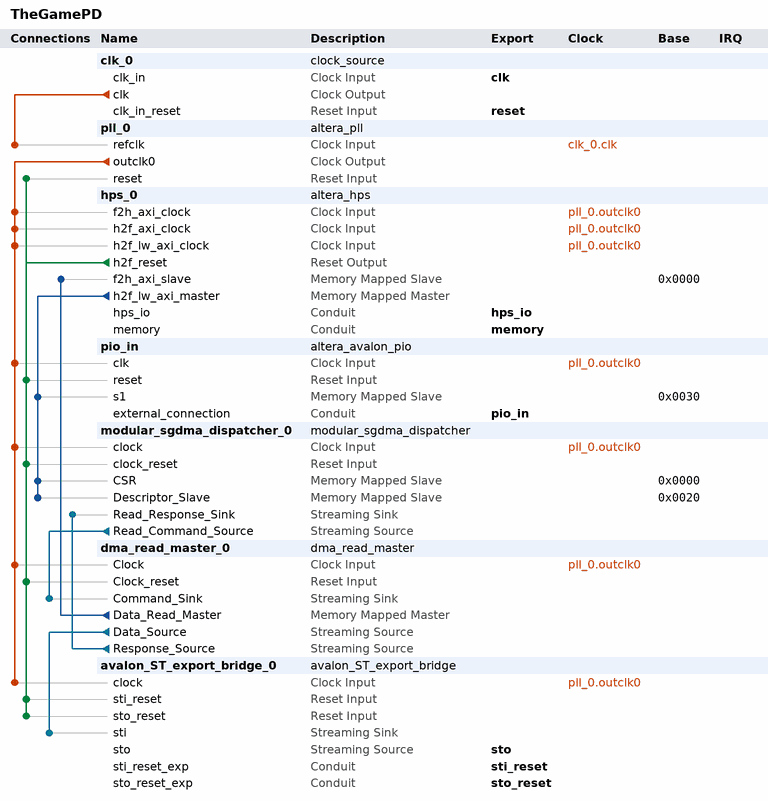
[diagram p0: system contents]
# Platform Designer (Qsys) system TheGamePD, Cyclone V 5CSXFC6D6F31C6
# Parameters at their usual value, and those the tool derives, are not listed.
package require -exact qsys 18.0
create_system TheGamePD
set_project_property DEVICE_FAMILY {Cyclone V}
set_project_property DEVICE 5CSXFC6D6F31C6

add_instance clk_0 clock_source 18.0
set_instance_parameter_value clk_0 clockFrequency 50000000

add_instance pll_0 altera_pll 18.0
set_instance_parameter_value pll_0 gui_device_speed_grade 2
set_instance_parameter_value pll_0 gui_number_of_clocks 1
set_instance_parameter_value pll_0 gui_operation_mode direct
set_instance_parameter_value pll_0 gui_output_clock_frequency0 100.0
set_instance_parameter_value pll_0 gui_pll_mode {Integer-N PLL}
set_instance_parameter_value pll_0 gui_reference_clock_frequency 50.0
set_instance_parameter_value pll_0 gui_use_locked true

add_instance hps_0 altera_hps 18.0
set_instance_parameter_value hps_0 EMAC1_Mode RGMII
set_instance_parameter_value hps_0 EMAC1_PinMuxing {HPS I/O Set 0}
set_instance_parameter_value hps_0 F2SCLK_COLDRST_Enable false
set_instance_parameter_value hps_0 F2SCLK_DBGRST_Enable false
set_instance_parameter_value hps_0 F2SCLK_WARMRST_Enable false
set_instance_parameter_value hps_0 F2SINTERRUPT_Enable true
set_instance_parameter_value hps_0 F2S_Width 2
set_instance_parameter_value hps_0 FPGA_PERIPHERAL_OUTPUT_CLOCK_FREQ_EMAC0_GTX_CLK 100
set_instance_parameter_value hps_0 FPGA_PERIPHERAL_OUTPUT_CLOCK_FREQ_EMAC0_MD_CLK 100.0
set_instance_parameter_value hps_0 FPGA_PERIPHERAL_OUTPUT_CLOCK_FREQ_EMAC1_GTX_CLK 100
set_instance_parameter_value hps_0 FPGA_PERIPHERAL_OUTPUT_CLOCK_FREQ_EMAC1_MD_CLK 100.0
set_instance_parameter_value hps_0 HPS_PROTOCOL DDR3
set_instance_parameter_value hps_0 I2C0_Mode I2C
set_instance_parameter_value hps_0 I2C0_PinMuxing {HPS I/O Set 0}
set_instance_parameter_value hps_0 I2C1_Mode I2C
set_instance_parameter_value hps_0 I2C1_PinMuxing {HPS I/O Set 0}
set_instance_parameter_value hps_0 LWH2F_Enable true
set_instance_parameter_value hps_0 MEM_BANKADDR_WIDTH 3
set_instance_parameter_value hps_0 MEM_CLK_FREQ 400.0
set_instance_parameter_value hps_0 MEM_COL_ADDR_WIDTH 10
set_instance_parameter_value hps_0 MEM_DQ_WIDTH 32
set_instance_parameter_value hps_0 MEM_DRV_STR RZQ/6
set_instance_parameter_value hps_0 MEM_ROW_ADDR_WIDTH 15
set_instance_parameter_value hps_0 MEM_RTT_NOM RZQ/6
set_instance_parameter_value hps_0 MEM_RTT_WR {Dynamic ODT off}
set_instance_parameter_value hps_0 MEM_TCL 11
set_instance_parameter_value hps_0 MEM_TFAW_NS 45.0
set_instance_parameter_value hps_0 MEM_TRAS_NS 35.0
set_instance_parameter_value hps_0 MEM_TRCD_NS 13.75
set_instance_parameter_value hps_0 MEM_TRFC_NS 260.0
set_instance_parameter_value hps_0 MEM_TRP_NS 13.75
set_instance_parameter_value hps_0 MEM_VENDOR Micron
set_instance_parameter_value hps_0 MEM_WTCL 7
set_instance_parameter_value hps_0 QSPI_Mode {1 SS}
set_instance_parameter_value hps_0 QSPI_PinMuxing {HPS I/O Set 0}
set_instance_parameter_value hps_0 REF_CLK_FREQ 25.0
set_instance_parameter_value hps_0 S2FCLK_USER2CLK 5
set_instance_parameter_value hps_0 S2F_Width 2
set_instance_parameter_value hps_0 SDIO_Mode {4-bit Data}
set_instance_parameter_value hps_0 SDIO_PinMuxing {HPS I/O Set 0}
set_instance_parameter_value hps_0 SPIM0_Mode {Single Slave Select}
set_instance_parameter_value hps_0 SPIM0_PinMuxing {HPS I/O Set 0}
set_instance_parameter_value hps_0 SPIM1_Mode {Single Slave Select}
set_instance_parameter_value hps_0 SPIM1_PinMuxing {HPS I/O Set 0}
set_instance_parameter_value hps_0 STM_Enable false
set_instance_parameter_value hps_0 TIMING_BOARD_AC_SKEW 0.02
set_instance_parameter_value hps_0 TIMING_BOARD_AC_TO_CK_SKEW 0.01
set_instance_parameter_value hps_0 TIMING_BOARD_DQ_TO_DQS_SKEW 0.05
set_instance_parameter_value hps_0 TIMING_BOARD_MAX_CK_DELAY 0.03
set_instance_parameter_value hps_0 TIMING_BOARD_MAX_DQS_DELAY 0.02
set_instance_parameter_value hps_0 TIMING_BOARD_SKEW_BETWEEN_DQS 0.06
set_instance_parameter_value hps_0 TIMING_BOARD_SKEW_CKDQS_DIMM_MAX 0.12
set_instance_parameter_value hps_0 TIMING_BOARD_SKEW_CKDQS_DIMM_MIN 0.06
set_instance_parameter_value hps_0 TIMING_BOARD_SKEW_WITHIN_DQS 0.01
set_instance_parameter_value hps_0 TIMING_TDH 65
set_instance_parameter_value hps_0 TIMING_TDQSCK 255
set_instance_parameter_value hps_0 TIMING_TDQSQ 125
set_instance_parameter_value hps_0 TIMING_TDS 30
set_instance_parameter_value hps_0 TIMING_TIH 140
set_instance_parameter_value hps_0 TIMING_TIS 190
set_instance_parameter_value hps_0 TIMING_TQSH 0.4
set_instance_parameter_value hps_0 UART0_Mode {No Flow Control}
set_instance_parameter_value hps_0 UART0_PinMuxing {HPS I/O Set 0}
set_instance_parameter_value hps_0 USB1_Mode SDR
set_instance_parameter_value hps_0 USB1_PinMuxing {HPS I/O Set 0}
set_instance_parameter_value hps_0 desired_cfg_clk_mhz 100.0
set_instance_parameter_value hps_0 desired_qspi_clk_mhz 400.0

add_instance pio_in altera_avalon_pio 18.0
set_instance_parameter_value pio_in direction Input
set_instance_parameter_value pio_in width 5

add_instance modular_sgdma_dispatcher_0 modular_sgdma_dispatcher 18.0
set_instance_parameter_value modular_sgdma_dispatcher_0 BURST_ENABLE 0
set_instance_parameter_value modular_sgdma_dispatcher_0 BURST_WRAPPING_SUPPORT 0
set_instance_parameter_value modular_sgdma_dispatcher_0 CSR_ADDRESS_WIDTH 3
set_instance_parameter_value modular_sgdma_dispatcher_0 DATA_FIFO_DEPTH 32
set_instance_parameter_value modular_sgdma_dispatcher_0 DATA_WIDTH 32
set_instance_parameter_value modular_sgdma_dispatcher_0 DESCRIPTOR_FIFO_DEPTH 128
set_instance_parameter_value modular_sgdma_dispatcher_0 ENHANCED_FEATURES 0
set_instance_parameter_value modular_sgdma_dispatcher_0 GUI_RESPONSE_PORT 0
set_instance_parameter_value modular_sgdma_dispatcher_0 MAX_BURST_COUNT 2
set_instance_parameter_value modular_sgdma_dispatcher_0 MAX_BYTE 1024
set_instance_parameter_value modular_sgdma_dispatcher_0 MAX_STRIDE 1
set_instance_parameter_value modular_sgdma_dispatcher_0 MODE 1
set_instance_parameter_value modular_sgdma_dispatcher_0 PREFETCHER_USE_CASE 0
set_instance_parameter_value modular_sgdma_dispatcher_0 PROGRAMMABLE_BURST_ENABLE 0
set_instance_parameter_value modular_sgdma_dispatcher_0 STRIDE_ENABLE 0
set_instance_parameter_value modular_sgdma_dispatcher_0 TRANSFER_TYPE {Aligned Accesses}

add_instance dma_read_master_0 dma_read_master 18.0
set_instance_parameter_value dma_read_master_0 BURST_ENABLE 0
set_instance_parameter_value dma_read_master_0 CHANNEL_ENABLE 0
set_instance_parameter_value dma_read_master_0 CHANNEL_WIDTH 8
set_instance_parameter_value dma_read_master_0 DATA_WIDTH 8
set_instance_parameter_value dma_read_master_0 ERROR_ENABLE 0
set_instance_parameter_value dma_read_master_0 ERROR_WIDTH 8
set_instance_parameter_value dma_read_master_0 FIFO_DEPTH 32
set_instance_parameter_value dma_read_master_0 FIFO_SPEED_OPTIMIZATION 1
set_instance_parameter_value dma_read_master_0 FIX_ADDRESS_WIDTH 32
set_instance_parameter_value dma_read_master_0 GUI_BURST_WRAPPING_SUPPORT 0
set_instance_parameter_value dma_read_master_0 GUI_MAX_BURST_COUNT 2
set_instance_parameter_value dma_read_master_0 GUI_PROGRAMMABLE_BURST_ENABLE 0
set_instance_parameter_value dma_read_master_0 GUI_STRIDE_WIDTH 1
set_instance_parameter_value dma_read_master_0 LENGTH_WIDTH 32
set_instance_parameter_value dma_read_master_0 PACKET_ENABLE 1
set_instance_parameter_value dma_read_master_0 STRIDE_ENABLE 0
set_instance_parameter_value dma_read_master_0 TRANSFER_TYPE {Aligned Accesses}
set_instance_parameter_value dma_read_master_0 USE_FIX_ADDRESS_WIDTH 0

add_instance avalon_ST_export_bridge_0 avalon_ST_export_bridge 1.0
set_instance_parameter_value avalon_ST_export_bridge_0 data_width 8

# connections
add_connection clk_0.clk pll_0.refclk clock
add_connection pll_0.outclk0 avalon_ST_export_bridge_0.clock clock
add_connection pll_0.outclk0 dma_read_master_0.Clock clock
add_connection pll_0.outclk0 hps_0.f2h_axi_clock clock
add_connection pll_0.outclk0 hps_0.h2f_axi_clock clock
add_connection pll_0.outclk0 hps_0.h2f_lw_axi_clock clock
add_connection pll_0.outclk0 modular_sgdma_dispatcher_0.clock clock
add_connection pll_0.outclk0 pio_in.clk clock
add_connection hps_0.h2f_reset avalon_ST_export_bridge_0.sti_reset reset
add_connection hps_0.h2f_reset avalon_ST_export_bridge_0.sto_reset reset
add_connection hps_0.h2f_reset dma_read_master_0.Clock_reset reset
add_connection hps_0.h2f_reset modular_sgdma_dispatcher_0.clock_reset reset
add_connection hps_0.h2f_reset pio_in.reset reset
add_connection hps_0.h2f_reset pll_0.reset reset
add_connection dma_read_master_0.Data_Read_Master hps_0.f2h_axi_slave avalon
set_connection_parameter_value dma_read_master_0.Data_Read_Master/hps_0.f2h_axi_slave baseAddress 0x0000
add_connection hps_0.h2f_lw_axi_master modular_sgdma_dispatcher_0.CSR avalon
set_connection_parameter_value hps_0.h2f_lw_axi_master/modular_sgdma_dispatcher_0.CSR baseAddress 0x0000
add_connection hps_0.h2f_lw_axi_master modular_sgdma_dispatcher_0.Descriptor_Slave avalon
set_connection_parameter_value hps_0.h2f_lw_axi_master/modular_sgdma_dispatcher_0.Descriptor_Slave baseAddress 0x0020
add_connection hps_0.h2f_lw_axi_master pio_in.s1 avalon
set_connection_parameter_value hps_0.h2f_lw_axi_master/pio_in.s1 baseAddress 0x0030
add_connection dma_read_master_0.Data_Source avalon_ST_export_bridge_0.sti avalon_streaming
add_connection dma_read_master_0.Response_Source modular_sgdma_dispatcher_0.Read_Response_Sink avalon_streaming
add_connection modular_sgdma_dispatcher_0.Read_Command_Source dma_read_master_0.Command_Sink avalon_streaming

# exported interfaces
add_interface clk clock sink
set_interface_property clk EXPORT_OF clk_0.clk_in
add_interface hps_io conduit end
set_interface_property hps_io EXPORT_OF hps_0.hps_io
add_interface memory conduit end
set_interface_property memory EXPORT_OF hps_0.memory
add_interface pio_in conduit end
set_interface_property pio_in EXPORT_OF pio_in.external_connection
add_interface reset reset sink
set_interface_property reset EXPORT_OF clk_0.clk_in_reset
add_interface sti_reset conduit end
set_interface_property sti_reset EXPORT_OF avalon_ST_export_bridge_0.sti_reset_exp
add_interface sto avalon_streaming source
set_interface_property sto EXPORT_OF avalon_ST_export_bridge_0.sto
add_interface sto_reset conduit end
set_interface_property sto_reset EXPORT_OF avalon_ST_export_bridge_0.sto_reset_exp

set_interconnect_requirement {$system} qsys_mm.clockCrossingAdapter HANDSHAKE
set_interconnect_requirement {$system} qsys_mm.enableEccProtection FALSE
set_interconnect_requirement {$system} qsys_mm.insertDefaultSlave FALSE
set_interconnect_requirement {$system} qsys_mm.maxAdditionalLatency 1

save_system TheGamePD.qsys
